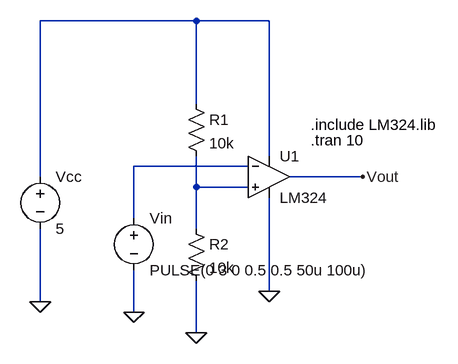
[diagram p0: schematic Comparator design draft.asc]
Comparator design draft.asc, the LTspice schematic file:
Version 4
SHEET 1 880 756
WIRE 64 256 -176 256
WIRE 176 256 64 256
WIRE 64 384 64 256
WIRE 176 464 176 256
WIRE 144 480 -32 480
WIRE -176 496 -176 256
WIRE 320 496 208 496
WIRE 64 512 64 464
WIRE 144 512 64 512
WIRE -32 560 -32 480
WIRE 64 576 64 512
WIRE 176 672 176 528
WIRE -176 688 -176 576
WIRE -32 704 -32 640
WIRE 64 736 64 656
FLAG -32 704 0
FLAG 64 736 0
FLAG 176 672 0
FLAG -176 688 0
FLAG 320 496 Vout
SYMBOL OpAmps\\opamp2 176 432 R0
SYMATTR InstName U1
SYMATTR Value LM324
SYMBOL voltage -176 480 R0
SYMATTR InstName Vcc
SYMATTR Value 5
SYMBOL voltage -32 544 R0
WINDOW 123 0 0 Left 0
WINDOW 39 0 0 Left 0
SYMATTR InstName Vin
SYMATTR Value PULSE(0 3 0 0.5 0.5 50u 100u)
SYMBOL res 48 368 R0
SYMATTR InstName R1
SYMATTR Value 10k
SYMBOL res 48 560 R0
SYMATTR InstName R2
SYMATTR Value 10k
TEXT 240 416 Left 2 !.include LM324.lib
TEXT 240 440 Left 2 !.tran 10

The netlist it stands for:
* Comparator design draft.asc
XU1 N003 N002 N001 0 Vout LM324  ; pins In+ In- V+ V- OUT
Vcc N001 0 5
Vin N002 0 PULSE(0 3 0 0.5 0.5 50u 100u)
R1 N001 N003 10k
R2 N003 0 10k
.include LM324.lib
.tran 10
.backanno
.end